# Altium schematic sheet EEM_Connectors.SchDoc: =DocumentName
size A4; SPICEModelCacheVGBTAUBO: <root> / <DocumentId>VGBTAUBO</DocumentId> / </root>; DocumentNumber: 1; Revision: 0; SheetNumber: 6; SheetTotal: 18
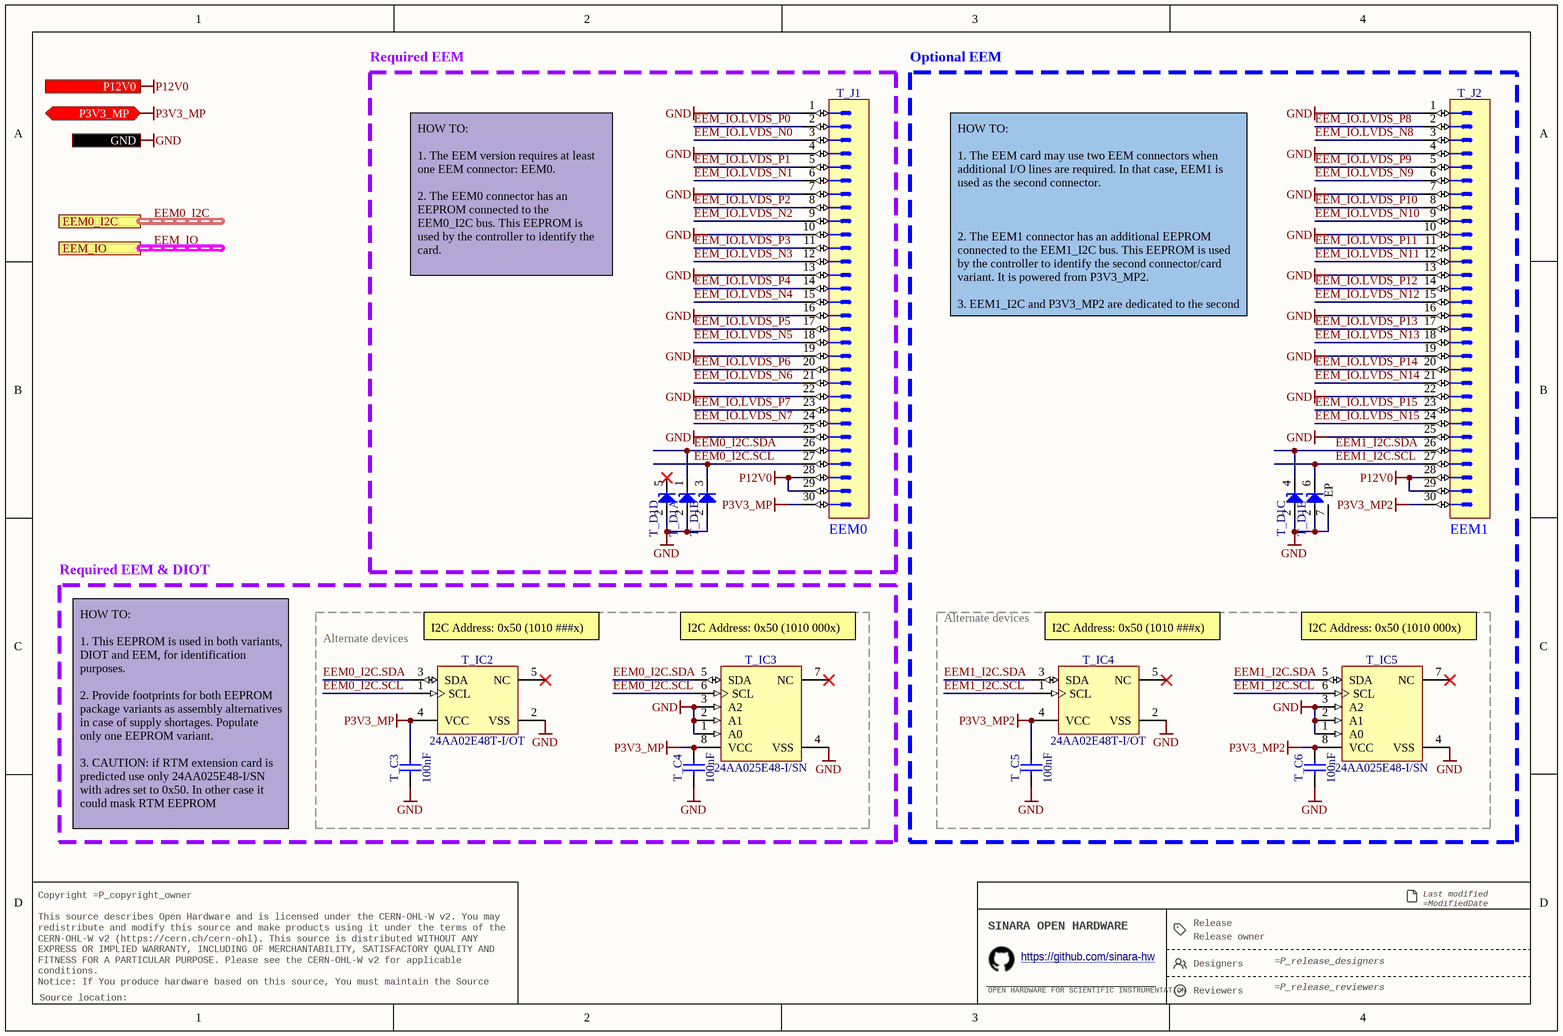
[diagram p0: EEM_Connectors.SchDoc]

## Parts
T_C3  100nF  [CAPC1005X55N]
T_C4  100nF  [CAPC1005X55N]
T_C5  100nF  [CAPC1005X55N]
T_C6  100nF  [CAPC1005X55N]
T_D1  UCLAMP3305P.TCT  [SON50P160X65_HS-7N]  (value not drawn)  (parts A,B,C,D,E of 5)
T_IC2  24AA02E48T-I/OT  [SOT95P280X145-5N]
T_IC3  24AA025E48-I/SN  [SOIC127P600X175-8N]
T_IC4  24AA02E48T-I/OT  [SOT95P280X145-5N]
T_IC5  24AA025E48-I/SN  [SOIC127P600X175-8N]
T_J1  (no value)  [3M_N2530-6002RB]
T_J2  (no value)  [3M_N2530-6002RB]

## Blocks framed on the sheet
Alternate devices: T_C3 T_C4 T_IC2 T_IC3
Alternate devices: T_C5 T_C6 T_IC4 T_IC5

## Ports
EEM0_I2C (harness I2C), EEM_IO (harness EEM_LVDS), GND, P3V3_MP (bidir), P12V0 (out)

## Nets
GND: T_C3.1 T_C4.1 T_C5.1 T_C6.1 T_D1.2(A) T_D1.7(EP) T_IC2.2(VSS) T_IC3.1(A0) T_IC3.2(A1) T_IC3.3(A2) T_IC3.4(VSS) T_IC4.2(VSS) T_IC5.1(A0) T_IC5.2(A1) T_IC5.3(A2) T_IC5.4(VSS) T_J1.1 T_J1.4 T_J1.7 T_J1.10 T_J1.13 T_J1.16 T_J1.19 T_J1.22 T_J1.25 T_J2.1 T_J2.4 T_J2.7 T_J2.10 T_J2.13 T_J2.16 T_J2.19 T_J2.22 T_J2.25 ; port GND
P3V3_MP: T_C3.2 T_C4.2 T_IC2.4(VCC) T_IC3.8(VCC) T_J1.30 ; port P3V3_MP
P3V3_MP2: T_C5.2 T_C6.2 T_IC4.4(VCC) T_IC5.8(VCC) T_J2.30
P12V0: T_J1.28 T_J1.29 T_J2.28 T_J2.29 ; port P12V0
EEM0_I2C.SCL: T_D1.3(C) T_IC2.1(SCL) T_IC3.6(SCL) T_J1.27
EEM0_I2C.SDA: T_D1.1(C) T_IC2.3(SDA) T_IC3.5(SDA) T_J1.26
EEM1_I2C.SCL: T_D1.6(C) T_IC4.1(SCL) T_IC5.6(SCL) T_J2.27
EEM1_I2C.SDA: T_D1.4(C) T_IC4.3(SDA) T_IC5.5(SDA) T_J2.26
EEM_IO.LVDS_N0: T_J1.3
EEM_IO.LVDS_N1: T_J1.6
EEM_IO.LVDS_N2: T_J1.9
EEM_IO.LVDS_N3: T_J1.12
EEM_IO.LVDS_N4: T_J1.15
EEM_IO.LVDS_N5: T_J1.18
EEM_IO.LVDS_N6: T_J1.21
EEM_IO.LVDS_N7: T_J1.24
EEM_IO.LVDS_N8: T_J2.3
EEM_IO.LVDS_N9: T_J2.6
EEM_IO.LVDS_N10: T_J2.9
EEM_IO.LVDS_N11: T_J2.12
EEM_IO.LVDS_N12: T_J2.15
EEM_IO.LVDS_N13: T_J2.18
EEM_IO.LVDS_N14: T_J2.21
EEM_IO.LVDS_N15: T_J2.24
EEM_IO.LVDS_P0: T_J1.2
EEM_IO.LVDS_P1: T_J1.5
EEM_IO.LVDS_P2: T_J1.8
EEM_IO.LVDS_P3: T_J1.11
EEM_IO.LVDS_P4: T_J1.14
EEM_IO.LVDS_P5: T_J1.17
EEM_IO.LVDS_P6: T_J1.20
EEM_IO.LVDS_P7: T_J1.23
EEM_IO.LVDS_P8: T_J2.2
EEM_IO.LVDS_P9: T_J2.5
EEM_IO.LVDS_P10: T_J2.8
EEM_IO.LVDS_P11: T_J2.11
EEM_IO.LVDS_P12: T_J2.14
EEM_IO.LVDS_P13: T_J2.17
EEM_IO.LVDS_P14: T_J2.20
EEM_IO.LVDS_P15: T_J2.23

Not connected (* = marked no-connect by the designer): T_D1 5(C)*; T_IC2 5(NC)*; T_IC3 7(NC)*; T_IC4 5(NC)*; T_IC5 7(NC)*

## Buses and harness runs
harness EEM0_I2C = port EEM0_I2C
harness EEM_IO = port EEM_IO

## Notes on the sheet
- Required EEM
- Optional EEM
- HOW TO:
  1. The EEM version requires at least one EEM connector: EEM0.
  2. The EEM0 connector has an EEPROM connected to the EEM0_I2C bus. This EEPROM is used by the controller to identify the card.
- HOW TO:
  1. The EEM card may use two EEM connectors when additional I/O lines are required. In that case, EEM1 is used as the second connector.
  2. The EEM1 connector has an additional EEPROM connected to the EEM1_I2C bus. This EEPROM is used by the controller to identify the second connector/card variant. It is powered from P3V3_MP2.
  3. EEM1_I2C and P3V3_MP2 are dedicated to the second EEPROM only. Do not use them for any other purpose.
- Required EEM & DIOT
- (near T_J1) EEM0
- (near T_J2) EEM1
- (near T_IC2) I2C Address: 0x50 (1010 ###x)
- (near T_IC3) I2C Address: 0x50 (1010 000x)
- (near T_IC4) I2C Address: 0x50 (1010 ###x)
- (near T_IC5) I2C Address: 0x50 (1010 000x)
- HOW TO:
  1. This EEPROM is used in both variants, DIOT and EEM, for identification purposes.
  2. Provide footprints for both EEPROM package variants as assembly alternatives in case of supply shortages. Populate only one EEPROM variant.
  3. CAUTION: if RTM extension card is predicted use only 24AA025E48-I/SN with adres set to 0x50. In other case it could mask RTM EEPROM
- Release
- Last modified =ModifiedDate
  Sheet =sheetnumber of =sheettotal · Size A4
- Copyright =P_copyright_owner
  This source describes Open Hardware and is licensed under the CERN-OHL-W v2. You may redistribute and modify this source and make products using it under the terms of the CERN-OHL-W v2 (https://cern.ch/cern-ohl). This source is distributed WITHOUT ANY EXPRESS OR IMPLIED WARRANTY, INCLUDING OF MERCHANTABILITY, SATISFACTORY QUALITY AND FITNESS FOR A PARTICULAR PURPOSE. Please see the CERN-OHL-W v2 for applicable conditions.
  Notice: If You produce hardware based on this source, You must maintain the Source Location visible on the product, its packaging or its documentation.
- SINARA OPEN HARDWARE
- OPEN HARDWARE FOR SCIENTIFIC INSTRUMENTATION
- https://github.com/sinara-hw
- Release owner
- Designers
- Reviewers
- Source location:

## Library data of the parts
T_C3-T_C6 = CC0402_100NF_50V_10%_X7R: Non-polarised capacitor; Part Description: SMD Multilayer Chip Ceramic Capacitor; Manufacturer: GENERIC; Manufacturer1 Part Number: GRM155R71H104KE14D; Voltage: 50V; TC: X7R; Tolerance: ±10%; Part Number: CC0402_100NF_50V_10%_X7R; Component Kind: Standard; Component Type: Standard; Pin Count: 2; Value: 100nF; Status: None; Manufacturer Part Number: CC0402_100NF_50V_10%_X7R; Case: 0402; Mounted: Yes; Socket: No; SMD: Yes; Sense: No; HelpURL: \\cern.ch\dfs\Applications\Altium\Datasheets\CC0402_MURATA_GRM155R71H104KE14D.pdf; Author: CERN DEM MR; CreateDate: 30.06.2017; LatestRevisionDate: 30.06.2017; Manufacturer1 Example: MURATA; Manufacturer1 ComponentHeight: 0.55mm
T_D1 = CMP-004-00037-2: Diode TVS Quint Common Anode Uni-Dir 3.3V 40W 6-Pin SLP EP T/R; Max Operating Temperature: 125°C; Min Operating Temperature: -55°C; Pins: 6; Mounting Technology: Surface Mount
T_IC2 T_IC4 = 24AA02E48T-I/OT: 1.7V-5.5V, 2K I2C Serial EEPROM With EUI-48 Node Identity; Manufacturer: MICROCHIP TECHNOLOGY; PressFit: No; Bonding: No; Part Number: 24AA02E48T-I/OT; Component Kind: Standard; Component Type: Standard; Device: 24AA02E48T-I/OT; PackageDescription: SOT, 0.95mm pitch; 5 pin, 1.60mm W X 2.90mm L X 1.45mm H body, IPC Medium Density; Part Description: 1.7V-5.5V, 2K I2C Serial EEPROM with EUI-48 Node Identity; Manufacturer Part Number: 24AA02E48T-I/OT; Pin Count: 5; Case: SOT23-5; Mounted: Yes; Socket: No; SMD: Yes; Sense: No; ComponentHeight: 1.45mm; HelpURL: \\cern.ch\dfs\Applications\Altium\Datasheets\24AA02E48T-I-OT.pdf; Author: CERN DEM MR; CreateDate: 31.03.2016; LatestRevisionDate: 31.03.2016
T_IC3 T_IC5 = 24AA025E48-I/SN: 1.7V-5.5V, 2K I2C™ Serial EEPROMs with EUI-48™ Node Identity; Manufacturer: MICROCHIP TECHNOLOGY; PressFit: No; Bonding: No; Part Number: 24AA025E48-I/SN; Component Kind: Standard; Component Type: Standard; Device: 24AA025E48-I/SN; PackageDescription: SOIC 8, Pitch 1.27mm - Body 4x5mm, IPC Medium Density; Part Description: 1.7V-5.5V, 2K I2C™ Serial EEPROMs with EUI-48™ Node Identity; Manufacturer Part Number: 24AA025E48-I/SN; Pin Count: 8; Case: SOIC8; Mounted: Yes; Socket: No; SMD: Yes; Sense: No; ComponentHeight: 1.75mm; HelpURL: \\cern.ch\dfs\Applications\Altium\Datasheets\24AA025E48-I-SN.pdf; Author: CERN DEM MR; CreateDate: 19.07.2016; LatestRevisionDate: 19.07.2016
T_J1 T_J2 = 3M_N2530-6002RB: Connector 30 Male; Part Description: 30 Contacts - Straight .100'' x .100'' Low Profile Four-Wall Header, 2500 Series; Manufacturer: 3M; PressFit: No; Part Number: 3M_N2530-6002RB; Component Kind: Standard; Component Type: Standard; Pin Count: 30; Family: Header 30; Mounted: Yes; Socket: No; SMD: No; Sense: No; Status: None; Manufacturer Part Number: N2530-6002RB; ComponentHeight: 10.03mm; HelpURL: \\cern.ch\dfs\Applications\Altium\Datasheets\3M_N2530-6002RB.pdf; Author: CERN DEM JLC; CreateDate: 11.02.2009; LatestRevisionDate: 11.08.2009